# EAGLE design polarshield3.0b (EAGLE 7.2.0)
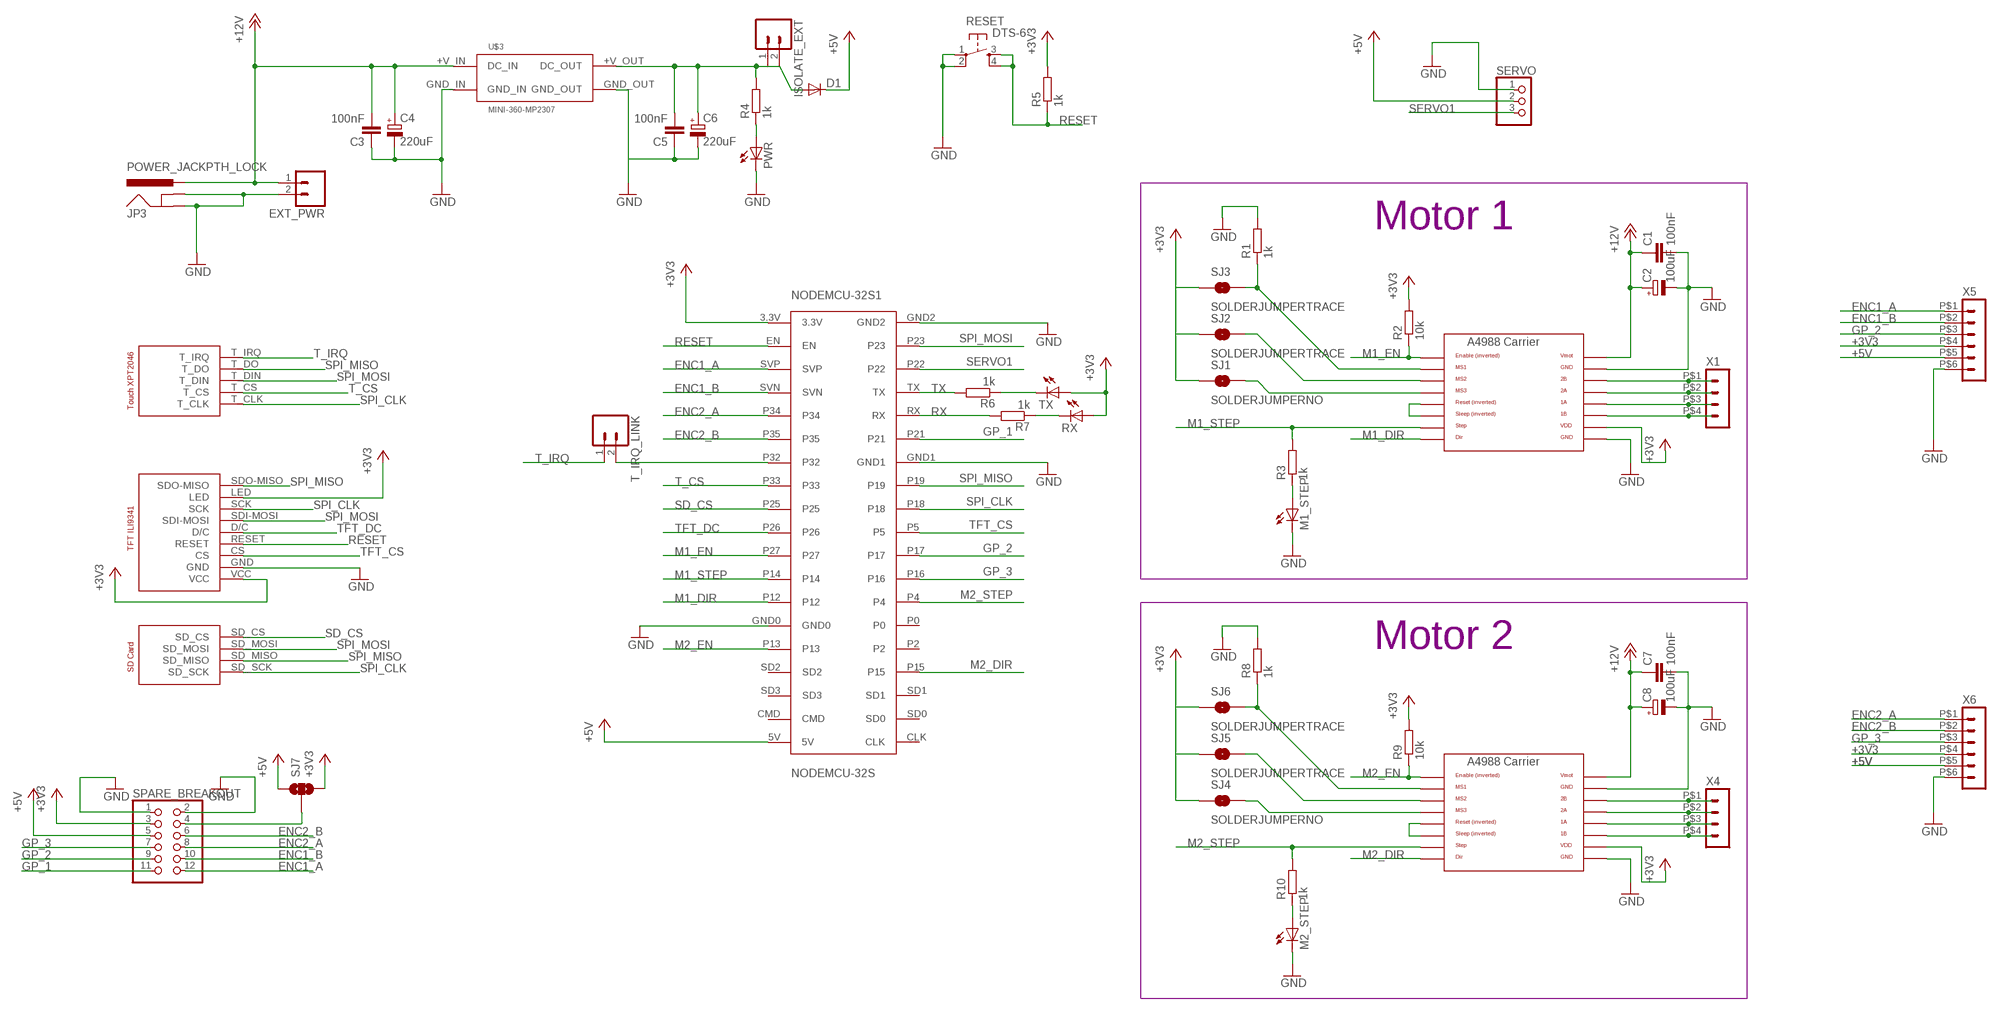
[diagram p0: schematic, sheet 1]

## Parts
C1  100nF  C-EUC0805  [C0805]
C2  100uF  CPOL-EU153CLV-0605  [153CLV-0605]
C3  100nF  C-EUC0805  [C0805]
C4  220uF  CPOL-EU153CLV-0605  [153CLV-0605]
C5  100nF  C-EUC0805  [C0805]
C6  220uF  CPOL-EU153CLV-0605  [153CLV-0605]
C7  100nF  C-EUC0805  [C0805]
C8  100uF  CPOL-EU153CLV-0605  [153CLV-0605]
D1  DIODE-DO214BA  [DO214BA]
EXT_PWR  M02PTH  [1X02]
ISOLATE_EXT  M02PTH  [1X02]
JP3  POWER_JACKPTH_LOCK  [POWER_JACK_PTH_LOCK]
M1_STEP  LEDCHIPLED_0805  [CHIPLED_0805]
M2_STEP  LEDCHIPLED_0805  [CHIPLED_0805]
MOTOR_1  A4988BREAKOUT  [A4988BREAKOUT]
MOTOR_2  A4988BREAKOUT  [A4988BREAKOUT]
NODEMCU-32S1  NODEMCU-32S  [NODEMCU-32S]
PWR  LEDCHIPLED_0805  [CHIPLED_0805]
R1  1k  R-EU_M0805  [M0805]
R2  10k  R-EU_M0805  [M0805]
R3  1k  R-EU_M0805  [M0805]
R4  1k  R-EU_M0805  [M0805]
R5  1k  R-EU_M0805  [M0805]
R6  1k  R-EU_M0805  [M0805]
R7  1k  R-EU_M0805  [M0805]
R8  1k  R-EU_M0805  [M0805]
R9  10k  R-EU_M0805  [M0805]
R10  1k  R-EU_M0805  [M0805]
RESET  DTS-6  [DTS-6]
RX  LEDCHIPLED_0805  [CHIPLED_0805]
SERVO  PINHD-1X3/90  [1X03/90]
SJ1  SOLDERJUMPERNO  [SJ_2S-NO]
SJ2  SOLDERJUMPERTRACE  [SJ_2S-TRACE]
SJ3  SOLDERJUMPERTRACE  [SJ_2S-TRACE]
SJ4  SOLDERJUMPERNO  [SJ_2S-NO]
SJ5  SOLDERJUMPERTRACE  [SJ_2S-TRACE]
SJ6  SOLDERJUMPERTRACE  [SJ_2S-TRACE]
SJ7  SOLDERJUMPER_2WAYPASTE1&2  [SJ_3_PASTE1&2]
SPARE_BREAKOUT  PINHD-2X6  [2X06]
T_IRQ_LINK  M02PTH  [1X02]
TX  LEDCHIPLED_0805  [CHIPLED_0805]
U$2  2.4_TFT_SPI_TOUCH_SD  [2.4_TFT_SPI_TOUCH_SD]
U$3  MINI-360-MP2307  [MINI-360-MP2307]
X1  HEADER_POS4_43045-0401  [43045-0400]
X4  HEADER_POS4_43045-0401  [43045-0400]
X5  HEADER_POS6_43045-0600  [43045-0600]
X6  HEADER_POS6_43045-0600  [43045-0600]

## Nets
+3V3 [VCC]: MOTOR_1.VDD MOTOR_2.VDD NODEMCU-32S1.3.3V R2.2 R5.2 R9.2 RX.A SJ1.1 SJ2.1 SJ3.1 SJ4.1 SJ5.1 SJ6.1 SJ7.3 SPARE_BREAKOUT.3 TX.A U$2.LED U$2.VCC X5.P$4 X6.P$4
+5V [VCC]: D1.C NODEMCU-32S1.5V SERVO.2 SJ7.1 SPARE_BREAKOUT.5 X5.P$5 X6.P$5
+12V [VMOT]: C1.1 C2.+ C3.2 C4.+ C7.1 C8.+ EXT_PWR.1 JP3.PWR MOTOR_1.VMOT MOTOR_2.VMOT U$3.+V_IN(DC_IN)
ENC1_A: NODEMCU-32S1.SVP SPARE_BREAKOUT.12 X5.P$1
ENC1_B: NODEMCU-32S1.SVN SPARE_BREAKOUT.10 X5.P$2
ENC2_A: NODEMCU-32S1.P34 SPARE_BREAKOUT.8 X6.P$1
ENC2_B: NODEMCU-32S1.P35 SPARE_BREAKOUT.6 X6.P$2
GND [GND]: C1.2 C2.- C3.1 C4.- C5.1 C6.- C7.2 C8.- EXT_PWR.2 JP3.GND JP3.GNDBREAK M1_STEP.C M2_STEP.C MOTOR_1.GND MOTOR_1.GND@0(GND) MOTOR_2.GND MOTOR_2.GND@0(GND) NODEMCU-32S1.GND0 NODEMCU-32S1.GND1 NODEMCU-32S1.GND2 PWR.C R1.2 R8.2 RESET.1 RESET.2 SERVO.1 SPARE_BREAKOUT.1 SPARE_BREAKOUT.2 U$2.GND U$3.GND_IN U$3.GND_OUT X5.P$6 X6.P$6
GP_1: NODEMCU-32S1.P21 SPARE_BREAKOUT.11
GP_2: NODEMCU-32S1.P17 SPARE_BREAKOUT.9 X5.P$3
GP_3: NODEMCU-32S1.P16 SPARE_BREAKOUT.7 X6.P$3
M1_DIR: MOTOR_1.DIR NODEMCU-32S1.P12
M1_EN: MOTOR_1.EN NODEMCU-32S1.P27 R2.1
M1_STEP: MOTOR_1.STEP NODEMCU-32S1.P14 R3.2
M2_DIR: MOTOR_2.DIR NODEMCU-32S1.P15
M2_EN: MOTOR_2.EN NODEMCU-32S1.P13 R9.1
M2_STEP: MOTOR_2.STEP NODEMCU-32S1.P4 R10.2
N$1: NODEMCU-32S1.P32 T_IRQ_LINK.2
N$2: MOTOR_1.RST MOTOR_1.SLP(SLEEP)
N$3: MOTOR_1.MS3 SJ1.2
N$4: MOTOR_1.MS2 SJ2.2
N$5: MOTOR_1.MS1 R1.1 SJ3.2
N$6: M1_STEP.A R3.1
N$7 [VCC]: C5.2 C6.+ D1.A ISOLATE_EXT.1 ISOLATE_EXT.2 R4.2 U$3.+V_OUT(DC_OUT)
N$8: PWR.A R4.1
N$9: MOTOR_2.MS3 SJ4.2
N$10 [VMOT]: MOTOR_1.2B X1.P$1
N$11 [VMOT]: MOTOR_1.2A X1.P$2
N$12 [VMOT]: MOTOR_1.1A X1.P$3
N$13 [VMOT]: MOTOR_1.1B X1.P$4
N$14: R6.1 TX.C
N$15: R7.1 RX.C
N$16: MOTOR_2.MS2 SJ5.2
N$17: MOTOR_2.MS1 R8.1 SJ6.2
N$18: MOTOR_2.RST MOTOR_2.SLP(SLEEP)
N$19: M2_STEP.A R10.1
N$24 [VMOT]: MOTOR_2.1B X4.P$4
N$25 [VMOT]: MOTOR_2.2B X4.P$1
N$26 [VMOT]: MOTOR_2.2A X4.P$2
N$27 [VMOT]: MOTOR_2.1A X4.P$3
N$28: SJ7.2 SPARE_BREAKOUT.4
RESET: NODEMCU-32S1.EN R5.1 RESET.3 RESET.4 U$2.RESET
RX: NODEMCU-32S1.RX R7.2
SD_CS: NODEMCU-32S1.P25 U$2.SD_CS
SERVO1: NODEMCU-32S1.P22 SERVO.3
SPI_CLK: NODEMCU-32S1.P18 U$2.SCK U$2.SD_SCK U$2.T_CLK
SPI_MISO: NODEMCU-32S1.P19 U$2.SD_MISO U$2.SDO-MISO U$2.T_DO
SPI_MOSI: NODEMCU-32S1.P23 U$2.SD_MOSI U$2.SDI-MOSI U$2.T_DIN
T_CS: NODEMCU-32S1.P33 U$2.T_CS
T_IRQ: T_IRQ_LINK.1 U$2.T_IRQ
TFT_CS: NODEMCU-32S1.P5 U$2.CS
TFT_DC: NODEMCU-32S1.P26 U$2.D/C
TX: NODEMCU-32S1.TX R6.2
Unconnected: NODEMCU-32S1.CLK NODEMCU-32S1.CMD NODEMCU-32S1.P0 NODEMCU-32S1.P2 NODEMCU-32S1.SD0 NODEMCU-32S1.SD1 NODEMCU-32S1.SD2 NODEMCU-32S1.SD3

## Notes on the sheet
- Motor 1
- Motor 2

## Library data of the parts
C1 C3 C5 C7 = resistor:C-EU: CAPACITOR, European symbol
C2 C4 C6 C8 = resistor:CPOL-EU: POLARIZED CAPACITOR, European symbol
D1 = diode:DIODE-: DIODE
EXT_PWR ISOLATE_EXT T_IRQ_LINK = SparkFun-Connectors:M02: Standard 2-pin 0.1" header. Use with - straight break away headers ( PRT-00116) - right angle break away headers (PRT-00553) - swiss pins (PRT-00743) - machine pins (PRT-00117) - female headers (PRT-00115) Molex polarized connector foot print use with: PRT-08233 with associated crimp pins and housings. 2.54_SCREWTERM for use with PRT-10571. 3.5mm Screw Terminal footprints for PRT-08084 5mm Screw Terminal footprints for use with PRT-08432
JP3 = SparkFun-Connectors:POWER_JACK: Power Jack This is the standard 5.5mm barrel jack for power. The PTH is the most common, proven, reliable, footprint. The Slot footprint only works if the mill layer is transmitted to the PCB fab house so be warned. Mating wall wart : TOL-00298 (and others); PROD_ID: CONN-08197; SF_ID: PRT-00119
M1_STEP M2_STEP PWR RX TX = polargraph3:LED: LED OSRAM: - CHIPLED LG R971, LG N971, LY N971, LG Q971, LY Q971, LO R971, LY R971 LH N974, LH R974 LS Q976, LO Q976, LY Q976 LO Q996 - Hyper CHIPLED LW Q18S LB Q993, LB Q99A, LB R99A - SideLED LS A670, LO A670, LY A670, LG A670, LP A670 LB A673, LV A673, LT A673, LW A673 LH A674 LY A675 LS A676, LA A676, LO A676, LY A676, LW A676 LS A679, LY A679, LG A679 - Hyper Micro SIDELED® LS Y876, LA Y876, LO Y876, LY Y876 LT Y87S - SmartLED LW L88C, LW L88S LB L89C, LB L89S, LG L890 LS L89K, LO L89K, LY L89K LS L896, LA L896, LO L896, LY L896 - TOPLED LS T670, LO T670, LY T670, LG T670, LP T670 LSG T670, LSP T670, LSY T670, LOP T670, LYG T670 LG T671, LOG T671, LSG T671 LB T673, LV T673, LT T673, LW T673 LH T674 LS T676, LA T676, LO T676, LY T676, LB T676, LH T676, LSB T676, LW T676 LB T67C, LV T67C, LT T67C, LS T67K, LO T67K, LY T67K, LW E67C LS E67B, LA E67B, LO E67B, LY E67B, LB E67C, LV E67C, LT E67C LW T67C LS T679, LY T679, LG T679 LS T770, LO T770, LY T770, LG T770, LP T770 LB T773, LV T773, LT T773, LW T773 LH T774 LS E675, LA E675, LY E675, LS T675 LS T776, LA T776, LO T776, LY T776, LB T776 LHGB T686 LT T68C, LB T68C - Hyper Mini TOPLED® LB M676 - Mini TOPLED Santana® LG M470 LS M47K, LO M47K, LY M47K Source: http://www.osram.convergy.de LUXEON: - LUMILED® LXK2-PW12-R00, LXK2-PW12-S00, LXK2-PW14-U00, LXK2-PW14-V00 LXK2-PM12-R00, LXK2-PM12-S00, LXK2-PM14-U00 LXK2-PE12-Q00, LXK2-PE12-R00, LXK2-PE12-S00, LXK2-PE14-T00, LXK2-PE14-U00 LXK2-PB12-K00, LXK2-PB12-L00, LXK2-PB12-M00, LXK2-PB14-N00, LXK2-PB14-P00, LXK2-PB14-Q00 LXK2-PR12-L00, LXK2-PR12-M00, LXK2-PR14-Q00, LXK2-PR14-R00 LXK2-PD12-Q00, LXK2-PD12-R00, LXK2-PD12-S00 LXK2-PH12-R00, LXK2-PH12-S00 LXK2-PL12-P00, LXK2-PL12-Q00, LXK2-PL12-R00 Source: www.luxeon.com KINGBRIGHT: KA-3528ASYC Source: www.kingbright.com
MOTOR_1 MOTOR_2 = sandy:A4988BREAKOUT
NODEMCU-32S1 = sandy:NODEMCU-32S
R1-R10 = resistor:R-EU_: RESISTOR, European symbol
RESET = switch-tact:DTS-6
SERVO = pinhead:PINHD-1X3: PIN HEADER
SJ1-SJ6 = polargraph3:SOLDERJUMPER: Solder Jumper Standard SMD solder jumper. Used to automate production. Two varients : Normally Open and Normally Closed are the same, but have different paste layers. NC will have a large amount of paste and should jumper during reflow.
SJ7 = SparkFun-Retired:SOLDERJUMPER_2WAY: Solder Jumper 2 way solder jumper
SPARE_BREAKOUT = pinhead:PINHD-2X6: PIN HEADER
U$2 = polargraph3:2.4_TFT_SPI_TOUCH_SD
U$3 = polargraph3:MINI-360-MP2307
X1 X4 = con-molex-micro-fit-3_0:HEADER_POS4_?: Molex - Micro-Fit 3.0 Series connector, 3.00mm (0.118") pitch header, 4 positions.
X5 X6 = con-molex-micro-fit-3_0:HEADER_POS6_?: Molex - Micro-Fit 3.0 Series connector, 3.00mm (0.118") pitch header, 6 positions.

## Net classes
0 signal: width 0.254 mm, drill 0.152 mm, clearance 0.203 mm
1 VMOT: width 1.118 mm, drill 0.152 mm, clearance 0.305 mm
2 VCC: width 0.61 mm, drill 0.152 mm, clearance 0.203 mm
3 GND: width 0.305 mm, drill 0.152 mm, clearance 0.203 mm

## Board
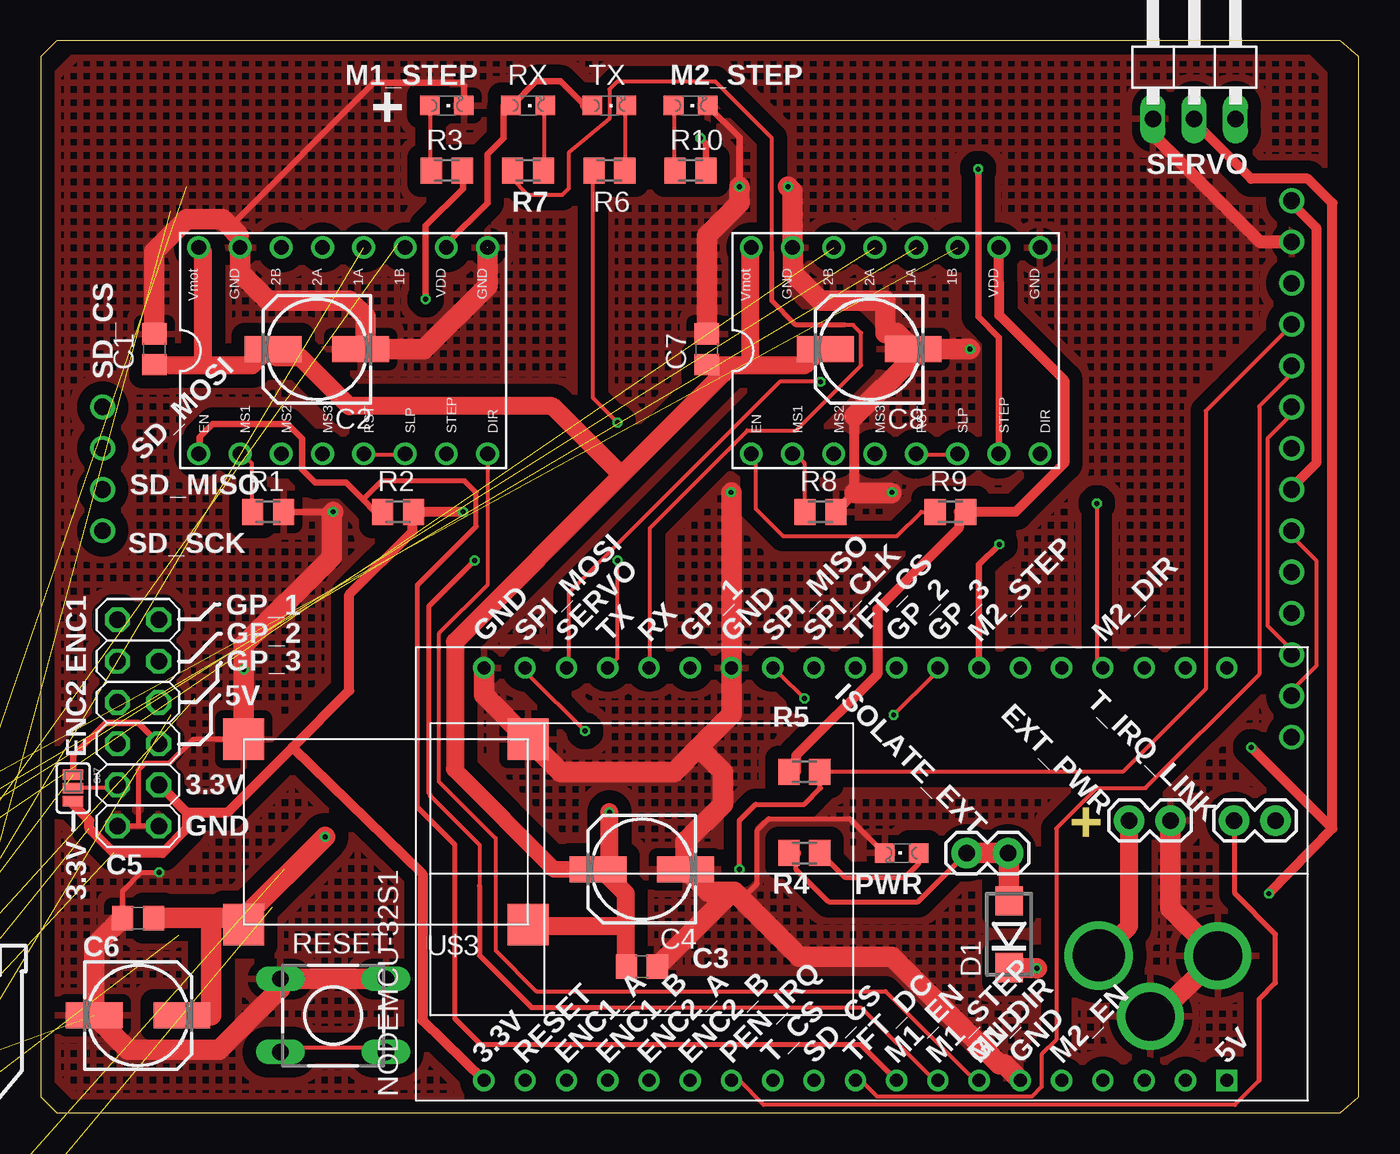
[diagram p1: board, top side]
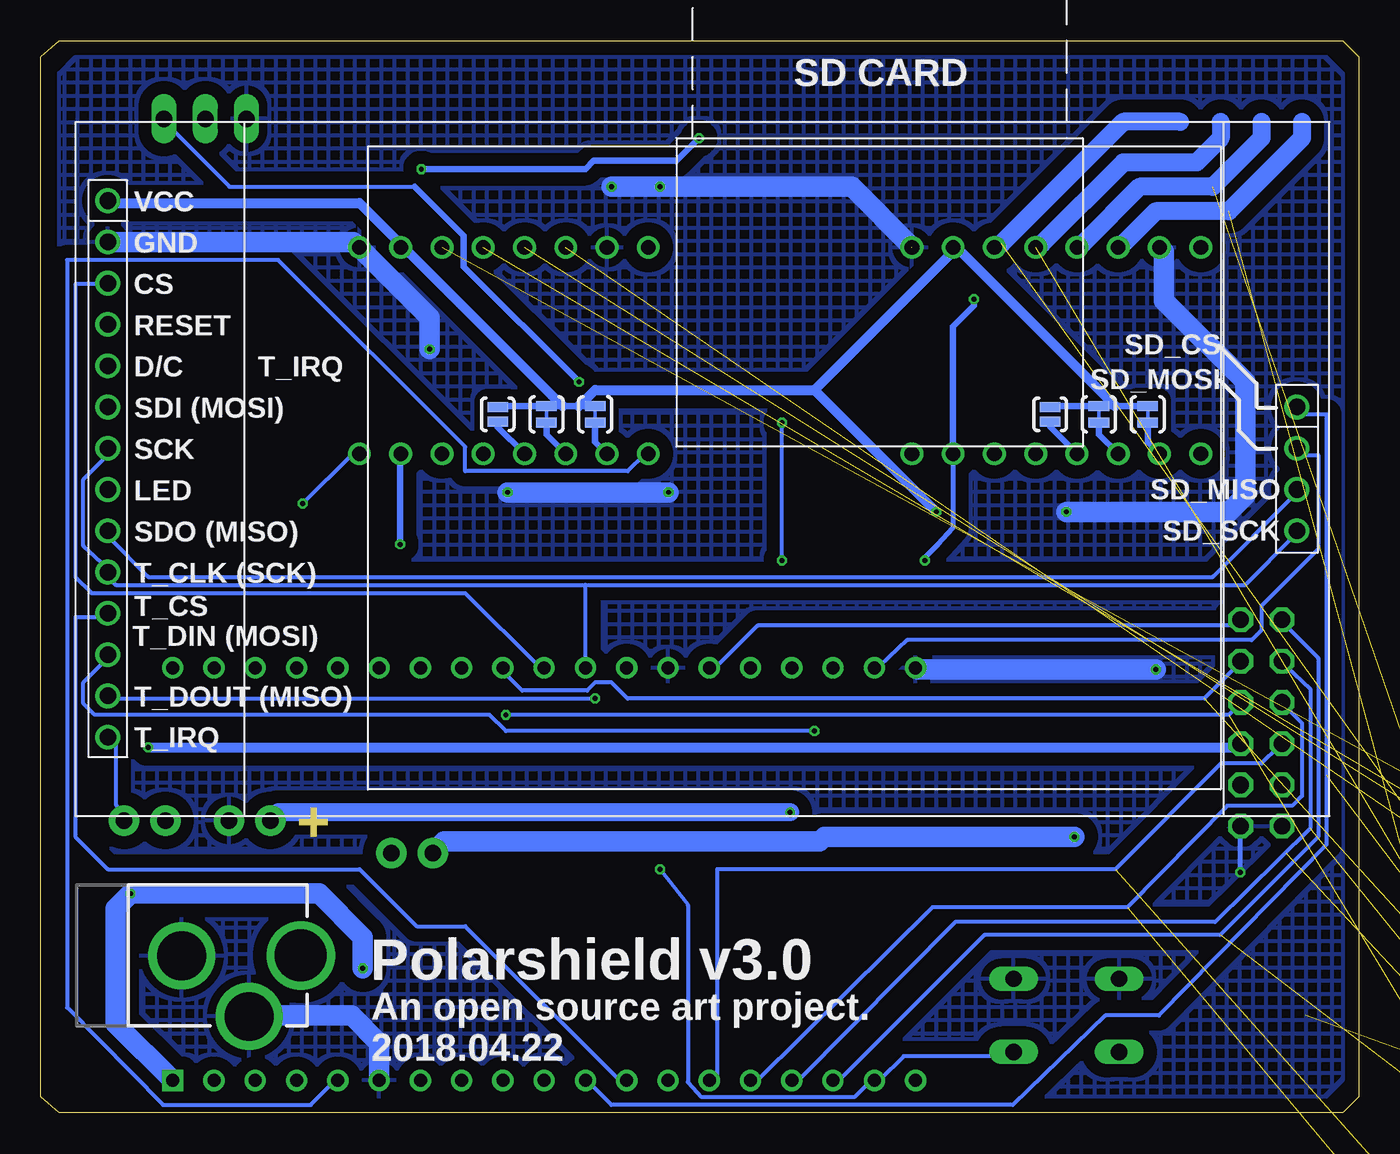
[diagram p2: board, bottom side, seen from below]

Size 81.13 x 66 mm. Coordinates in mm from the lower left corner, seen from the top.
Outline: 0,1 1,0 80,0 81.13,1 81.13,65 80,66 1,66 0,65 0,1
Copper layers (1*16): Top 0.035mm / dielectric 1.5mm / Bottom 0.035mm
Design rules "SeeedStudio_2layer_DRU_no_angle_20140221 *": minimum track width 6mil, minimum drill 12mil, track to track 6mil, track to pad 6mil, pad to pad 6mil, via to via 6mil, smd to smd 0mil, copper to edge 10mil, drill to drill 10mil, minimum pad ring 10mil, minimum via ring 6mil, stop-mask expansion 2mil, vias tented up to drill 100mil, thermal gap 20mil

### Footprints (pad centres in the part's own frame; a part is rotated, then mirrored left to right if it is on the bottom)
C0805 = smd 1.3 x 1.5: 1 -0.95,0; 2 0.95,0
153CLV-0605 = smd 3.5 x 1.6: + 2.7,0; - -2.7,0
DO214BA = smd 1.8 x 1.7: A 2.05,0; C -2.05,0
1X02 = drill 1.016 pad 1.88: 1 0,0; 2 2.54,0
POWER_JACK_PTH_LOCK = drill 2.997 pad 4.115: GND 0.025,6.557; GNDBREAK 3.762,10.7 | drill 3.2 pad 4.115: PWR 0,13.878
CHIPLED_0805 = smd 1.2 x 1.2: A 0,-1.05; C 0,1.05
A4988BREAKOUT = drill 0.9: 1A 8.89,1.27; 1B 11.43,1.27; 2A 6.35,1.27; 2B 3.81,1.27; DIR 16.51,-11.43; EN -1.27,-11.43; GND 16.51,1.27; GND@0 1.27,1.27; MS1 1.27,-11.43; MS2 3.81,-11.43; MS3 6.35,-11.43; RST 8.89,-11.43; SLP 11.43,-11.43; STEP 13.97,-11.43; VDD 13.97,1.27; VMOT -1.27,1.27
NODEMCU-32S = drill 0.8: 3.3V 0,45.72; CLK 25.4,0; CMD 0,2.54; EN 0,43.18; GND0 0,12.7; GND1 25.4,30.48; GND2 25.4,45.72; P0 25.4,12.7; P2 25.4,10.16; P4 25.4,15.24; P5 25.4,22.86; P12 0,15.24; P13 0,10.16; P14 0,17.78; P15 25.4,7.62; P16 25.4,17.78; P17 25.4,20.32; P18 25.4,25.4; P19 25.4,27.94; P21 25.4,33.02; P22 25.4,40.64; P23 25.4,43.18; P25 0,25.4; P26 0,22.86; P27 0,20.32; P32 0,30.48; P33 0,27.94; P34 0,35.56; P35 0,33.02; RX 25.4,35.56; SD0 25.4,2.54; SD1 25.4,5.08; SD2 0,7.62; SD3 0,5.08; SVN 0,38.1; SVP 0,40.64; TX 25.4,38.1 | drill 0.8 square: 5V 0,0
M0805 = smd 1.3 x 1.6: 1 -0.95,0; 2 0.95,0
DTS-6 = drill 1 long: 1 -3.25,2.25; 2 3.25,2.25; 3 -3.25,-2.25; 4 3.25,-2.25
1X03/90 = drill 1.016 long: 1 -2.54,-3.81; 2 0,-3.81; 3 2.54,-3.81
SJ_2S-NO = smd 0.635 x 1.27: 1 -0.45,0; 2 0.45,0
SJ_2S-TRACE = smd 0.635 x 1.27: 1 -0.508,0; 2 0.508,0
SJ_3_PASTE1&2 = smd 0.635 x 1.27: 1 -0.813,0; 2 0,0; 3 0.813,0
2X06 = drill 1.016 octagon: 1 -6.35,-1.27; 2 -6.35,1.27; 3 -3.81,-1.27; 4 -3.81,1.27; 5 -1.27,-1.27; 6 -1.27,1.27; 7 1.27,-1.27; 8 1.27,1.27; 9 3.81,-1.27; 10 3.81,1.27; 11 6.35,-1.27; 12 6.35,1.27
2.4_TFT_SPI_TOUCH_SD = drill 1.016: CS 9.93,2; D/C 15.01,2; GND 7.39,2; LED 22.63,2; RESET 12.47,2; SCK 20.09,2; SD_CS 17.55,75.18; SD_MISO 22.63,75.18; SD_MOSI 20.09,75.18; SD_SCK 25.17,75.18; SDI-MOSI 17.55,2; SDO-MISO 25.17,2; T_CLK 27.71,2; T_CS 30.25,2; T_DIN 32.79,2; T_DO 35.33,2; T_IRQ 37.87,2; VCC 4.85,2
MINI-360-MP2307 = smd 2.54 x 2.54: +V_IN -1,10.4; +V_OUT 16.5,10.4; GND_IN -1,-1; GND_OUT 16.5,-1
43045-0400 = drill 1.02 square: P$1 1.5,4.32 | drill 1.02: P$2 -1.5,4.32; P$3 1.5,7.32; P$4 -1.5,7.32 | hole 3: 0,0
43045-0600 = drill 1.02 square: P$1 3,4.32 | drill 1.02: P$2 0,4.32; P$3 -3,4.32; P$4 3,7.32; P$5 0,7.32; P$6 -3,7.32 | hole 3: 0,0

### Placement (x,y rotation side)
C1  7,47 90 top
C2  17,47 180 top
C3  37,9 180 top
C4  37,15 180 top
C5  6,12 0 top
C6  6,6 0 top
C7  41,47 90 top
C8  51,47 180 top
D1  59.6,11 90 top
EXT_PWR  67,18 0 top
ISOLATE_EXT  57,16 0 top
JP3  79,9.7 270 bottom
M1_STEP  25,62 270 top
M2_STEP  40,62 270 top
MOTOR_1  11,52 0 top
MOTOR_2  45,52 0 top
NODEMCU-32S1  73,2 90 top
PWR  53,16 90 top
R1  14,37 0 top
R2  22,37 0 top
R3  25,58 0 top
R4  47,16 180 top
R5  47,21 180 top
R6  35,58 180 top
R7  30,58 180 top
R8  48,37 0 top
R9  56,37 0 top
R10  40,58 0 top
RESET  18,6 0 top
RX  30,62 270 top
SERVO  71,65 0 top
SJ1  19,43 270 bottom
SJ2  16,43 270 bottom
SJ3  13,43 270 bottom
SJ4  53,43 270 bottom
SJ5  50,43 270 bottom
SJ6  47,43 270 bottom
SJ7  2,20 270 top
SPARE_BREAKOUT  6,24 90 top
T_IRQ_LINK  76,18 180 top
TX  35,62 270 top
U$2  79,61 270 bottom
U$3  29,22 180 top
X1  -6,5 0 top  (outside the outline)
X4  -17,5 0 top  (outside the outline)
X5  -15,-9 0 top  (outside the outline)
X6  -15,-23 0 top  (outside the outline)

### Tracks (layer width: path | path; a pad name or v marks a point on that pad's centre or on a via)
+3V3  (via drill 0.3)  (2 unrouted)
  Top 0.406: 29,62 30.5,63.5 32,63.5 33.5,62 | 25,53.5 27.5,56 27.5,59 28.5,60 28.5,62 RX.A
  Top 0.61: 9,18.5 9,17.5 7.5,16 4.5,16 3,17.5 3,18 2,19 SJ7.3 | 9,18.5 7.5,20 SPARE_BREAKOUT.3 | 15.5,22.5 11.5,18.5 9,18.5 | 15.5,22.5 19,26 19,31.9 22.9,35.8 22.9,36.95 R2.2 v26,37 | 15.5,22.5 23.5,14.7 23.5,5.7 NODEMCU-32S1.3.3V | 29,62 RX.A | 33.5,62 TX.A | 25,53.5 MOTOR_1.VDD | R5.2 46.5,21 46.5,22 51.5,27 51.5,31 56.5,36 56.5,37 R9.2 60,37 63,40 63,45.1 59,49.1 MOTOR_2.VDD | U$2.LED 77,38.5 78.5,40 78.5,54.5 77,56 U$2.VCC
  Bottom 0.406: SJ3.1 15,43.51 SJ2.1 19,43.51 SJ1.1 | SJ6.1 48,43.51 49,43.51 SJ5.1 52.94,43.51 SJ4.1
  Bottom 0.61: 15,43.51 15,43.5 24.5,53 MOTOR_1.VDD 25,53 33.5,44.5 | 49,43.51 49,43.5 58.5,53 MOTOR_2.VDD 59,53.5 61.5,56 77,56 U$2.VCC | 33.5,44.5 47,44.5 48,43.5 48,43.51 | 33.5,44.5 v26,37
+5V  (via drill 0.3)  (2 unrouted)
  Top 0.406: SJ7.1 2,22 4,24 6,24 SPARE_BREAKOUT.5
  Top 0.61: 79.5,17.5 79.5,56 78,57.5 74.5,57.5 71,61 SERVO.2 | v75.6,13.5 79.5,17.5 | 79.5,17.5 v74.5,22.5
  Top 1.27: v61.3,8.9 D1.C
  Bottom 0.61: v74.5,22.5 7.5,22.5 SPARE_BREAKOUT.5
  Bottom 1.27: v61.3,8.9 61.3,10.8 64,13.5 v75.6,13.5 76.5,12.6 76.5,5.5 NODEMCU-32S1.5V
+12V  (via drill 0.3)
  Top 1.016: 25.5,21.2 25.5,21.1 31.6,15 C4.+
  Top 1.118: EXT_PWR.1 67,11.5 65.5,10 JP3.PWR | 10,46 13,46 14,47 C2.+ 14.5,46.5 16,46.5 19,43.5 31.5,43.5 35.75,39.25 | 10,46 8,46 C1.1 | 10,46 10,53 MOTOR_1.VMOT | 36,11.5 36,13.5 35,14.5 | 36,11.5 36,9 C3.2 | 35,14.5 34.5,15 C4.+ | 36,11.5 30,11.5 U$3.+V_IN | 43.7,46 47,46 48,47 C8.+ | 43.7,46 42,46 C7.1 42,45.5 35.75,39.25 | 43.7,46 43.7,53 MOTOR_2.VMOT | 25.5,21.2 25.5,29 35.75,39.25 | 34,15 C4.+ | 35,14.5 v35,18.5 | 35,14.5 C4.+
  Bottom 1.118: EXT_PWR.1 66.5,18.5 v35,18.5
ENC1_A  (1 unrouted)
  Bottom 0.254: NODEMCU-32S1.SVP 32,2 23.04,10.96 8.54,10.96 2.5,17 2.5,28 4.5,30 SPARE_BREAKOUT.12
ENC1_B  (1 unrouted)
  Bottom 0.254: NODEMCU-32S1.SVN 34.5,2 24.84,11.76 8.84,11.76 3,17.5 3,26.1 4.5,27.5 SPARE_BREAKOUT.10
ENC2_A  (1 unrouted)
  Bottom 0.254: NODEMCU-32S1.P34 37,2 26.24,12.66 14.24,12.66 8.1,18.9 4.1,18.9 3.5,19.5 3.5,24 4.5,25 SPARE_BREAKOUT.8
ENC2_B  (1 unrouted)
  Bottom 0.254: NODEMCU-32S1.P35 39.5,2 39.5,15 15,15 8.5,21.5 6,21.5 5,22.5 SPARE_BREAKOUT.6
GND  (via drill 0.3)  (3 unrouted)
  Top 0.305: MOTOR_2.GND@0 46.73,53.27 | U$3.GND_OUT 9.4,23 7.9,21.5 6.4,21.5 6,21.1 6,17.7 | 6,17.7 7.22,17.7 SPARE_BREAKOUT.1 | v52.4,38.2 52.35,38.15 | PWR.C 51.9,16 49.8,18.1 44.8,18.1 44.1,17.4 44.1,14.1 43.6,13.6 42.7,13.6 42.5,13.6 42.5,13.55 | 14.75,7.65 RESET.1 | 6,17.7 5.95,17.65 SPARE_BREAKOUT.2 | C5.1 5.05,13.65 6.2,14.8 v7.3,14.8
  Top 0.406: R1.2 v18,37 | 11.65,54.55 20.5,63.4 25.9,63.4 26.05,63.25 M1_STEP.C | v43,57 43,60.05 M2_STEP.C
  Top 0.61: R8.2 50.1,38.15 50.1,42.9 | 53.7,46.5 C8.-
  Top 0.813: 12.2,54 12.2,53.34 MOTOR_1.GND@0 | 20,47.3 C2.- | MOTOR_1.GND | M1_STEP.C 26.2,62 | SERVO.1 68.46,60.22 75.07,53.61 U$2.GND
  Top 1.27: v46,57 46.27,56.73 MOTOR_2.GND@0 46.3,53.24 46.3,51.7 48,50 52,50 52,48 52.7,48 C8.- v57.2,47 | v43,57 43,56 41,54 C7.2 | C1.2 7,53 9,55 11.2,55 11.65,54.55 12.2,54 | MOTOR_1.GND@0 12.27,51.73 14,50 19,50 20,49 20,47.3 | C2.- 23.6,47 27.5,50.9 MOTOR_1.GND | 50.1,42.9 53.7,46.5 | 42.52,38.18 NODEMCU-32S1.GND1 42.52,24.52 40.5,22.5 | 52.35,38.15 50.1,38.15 | 42.5,13.6 41.1,13.6 C4.- 39.7,16.7 42,19 42,21 40.5,22.5 | NODEMCU-32S1.GND0 59.3,3 59,3 52.4,9.6 46.7,9.6 42.7,13.6 | C3.1 42.5,13.55 | RESET.2 RESET.1 | 14.75,7.65 11,3.9 5.4,3.9 C6.- 3.3,10.25 C5.1 | EXT_PWR.2 69.54,12.58 JP3.GND 68.71,5.94 JP3.GNDBREAK | NODEMCU-32S1.GND2 27.28,25.72 U$3.GND_IN 32,21 39,21 40.5,22.5 | U$3.GND_OUT v12.5,27.3 12.5,28.8 17.9,34.2 17.9,36.9 v18,37
  Bottom 0.305: v7.3,14.8 7.3,17.62 SPARE_BREAKOUT.1
  Bottom 1.27: v46,57 v43,57 31.2,57 27.5,53.3 | v57.2,47 57.2,48.96 MOTOR_2.GND 61.47,53.27 61.9,53.6 76.91,53.6 U$2.GND | v42.5,38.2 v52.4,38.2 | v18,37 8,37 7,38 7,45 12,50 12,53 MOTOR_1.GND@0 | NODEMCU-32S1.GND0 60.3,4.3 62,6 68.24,6 JP3.GNDBREAK | v12.5,27.3 27.18,27.3 NODEMCU-32S1.GND2
  pour Top (isolate 0.813, hatched): 1,64 2,65 78,65 79,64 79,2 78,1 2,1 1,2
  pour Bottom (isolate 0.813, hatched): 2,65 1,64 1,2 2,1 79,1 80,2 80,64 79,65
GP_1
  Bottom 0.254: NODEMCU-32S1.P21 39.5,27.5 37,30 7.5,30 SPARE_BREAKOUT.11
GP_2  (1 unrouted)
  Bottom 0.254: NODEMCU-32S1.P17 52.5,27 51.5,26 47.5,26 47,26.5 46,26.5 45,25.5 9.5,25.5 7.5,27.5 SPARE_BREAKOUT.9
GP_3  (via drill 0.3)  (1 unrouted)
  Top 0.254: v52.5,24.5 55,27 NODEMCU-32S1.P16
  Bottom 0.254: v52.5,24.5 8,24.5 7.5,25 SPARE_BREAKOUT.7
M1_DIR
  Top 0.254: 27.5,40.5 27.5,32.5 24.5,29.5 24.5,20.4 28,16.9 28,10 30.5,7.5 52,7.5 57.5,2 NODEMCU-32S1.P12
  Top 0.305: MOTOR_1.DIR 27.51,40.51 27.5,40.5
M1_EN
  Top 0.254: 21,37 R2.1
  Top 0.305: NODEMCU-32S1.P27 50.48,4.2 27.1,4.2 25.5,5.8 25.5,16.5 23.2,18.8 23.2,32.5 26.8,36.1 26.8,38.2 26.1,38.9 21,38.9 19.85,37.75
  Top 0.406: 21,37 20.6,37 19.85,37.75 18.8,38.8 16.9,38.8 16.1,39.6 16.1,41.5 15.2,42.4 10.6,42.4 9.8,41.6 9.8,40.64 MOTOR_1.EN
M1_STEP  (via drill 0.3)
  Top 0.254: 25.5,58 R3.2 | 34.5,6.5 50.5,6.5 55,2 NODEMCU-32S1.P14 | 27,14 27,16.5 24,19.5
  Top 0.305: 27,14 27,9.7 30.2,6.5 34.5,6.5 | 24,19.5 23.9,19.7 23.9,31.2 v26.7,34
  Top 0.406: R3.2 26,57.95 26,56.9 23.7,54.6 v23.7,50.1
  Bottom 0.305: MOTOR_1.STEP 24.97,36.53 25,36 25.9,35 26.7,34.2 v26.7,34
  Bottom 0.406: v23.7,50.1 23.7,49.7 25,48.4 25,40.6 MOTOR_1.STEP
M2_DIR  (via drill 0.3)
  Top 0.254: v65,37.5 65,27.5 NODEMCU-32S1.P15
  Bottom 0.254: v65,37.5 62,40.5 MOTOR_2.DIR
M2_EN
  Top 0.254: R9.1 54.2,37 52.7,35.5 45.7,35.5 44,37.2 44,40.5 MOTOR_2.EN
  Bottom 0.254: NODEMCU-32S1.P13 63,2 64.5,0.5 73.6,0.5 79.5,6.5 79.5,52.5 66.5,52.5 55,41 55,39.5 45,39.5 44,40.5 MOTOR_2.EN
M2_STEP  (via drill 0.3)
  Top 0.406: R10.2 40.95,59.65 v40.6,60 | NODEMCU-32S1.P4 57.76,33.76 v59,35 | MOTOR_2.STEP 58.97,47.73 57.7,49 v57.7,58.1
  Bottom 0.406: v59,35 59,40.54 MOTOR_2.STEP | v57.7,58.1 47.6,58.1 47.1,58.6 42,58.6 v40.6,60
N$1
  Top 0.254: 75,2 73.5,0.5 44.5,0.5 43,2 NODEMCU-32S1.P32
  Top 0.305: 75,2 75,7 76,8 76,11 73.5,13.5 73.5,17.96 T_IRQ_LINK.2
N$2
  Top 0.254: MOTOR_1.RST 20,40.5 22,40.5 MOTOR_1.SLP
N$3
  Bottom 0.406: SJ1.2 19,42.22 MOTOR_1.MS3
N$4
  Bottom 0.406: SJ2.2 16,41.76 MOTOR_1.MS2
N$5
  Top 0.254: R1.1 13,37 13,40 12.5,40.5 MOTOR_1.MS1
  Bottom 0.406: SJ3.2 13,41.3 MOTOR_1.MS1
N$6
  Top 0.254: M1_STEP.A 24,62 24,58 R3.1
N$7  (via drill 0.3)
  Top 0.305: 46.5,16 46.5,15 48.5,13 54,13 ISOLATE_EXT.1
  Top 0.61: 10.5,6 C6.+ | 46.5,16 R4.2 | 12.5,12 U$3.+V_OUT
  Top 1.27: 10.5,12 12.5,12 v17.5,17 | 10.5,12 C5.2 | 10.5,12 10.5,6 | D1.A 59.6,15.94 ISOLATE_EXT.2 ISOLATE_EXT.1
  Bottom 1.27: v17.5,17 32.9,17 33.2,16.7 56.3,16.7 ISOLATE_EXT.1
N$8
  Top 0.254: 54,16 PWR.A | 48,16 R4.1
  Top 0.305: 48,16 49.5,14.5 53.2,14.5 54.05,15.35 PWR.A
N$9
  Bottom 0.406: SJ4.2 53,42.22 MOTOR_2.MS3
N$10  (1 unrouted)
  Bottom 1.118: 3.5,61 3.5,60 8,55.5 12.5,55.5 14.5,53.5 MOTOR_1.2B
N$11  (1 unrouted)
  Bottom 1.118: 6,61 6,60 9,57 13.5,57 17,53.5 MOTOR_1.2A
N$12  (1 unrouted)
  Bottom 1.118: 8.5,61 8.5,60 10,58.5 14.5,58.5 19.5,53.5 MOTOR_1.1A
N$13  (1 unrouted)
  Bottom 1.118: 11,61 14.5,61 22,53.5 MOTOR_1.1B
N$14
  Top 0.254: TX.C 36,62 36,58 R6.1
N$15
  Top 0.254: RX.C 31,62 31,58 R7.1
N$16
  Bottom 0.406: SJ5.2 50,41.76 MOTOR_2.MS2
N$17
  Top 0.254: R8.1 47,37 47,40 46.5,40.5 MOTOR_2.MS1
  Bottom 0.406: SJ6.2 47,41.3 MOTOR_2.MS1
N$18
  Top 0.254: MOTOR_2.RST 54,40.5 56,40.5 MOTOR_2.SLP
N$19
  Top 0.254: M2_STEP.A 39,62 39,58 R10.1
N$24  (1 unrouted)
N$25  (1 unrouted)
N$26  (1 unrouted)
N$27  (1 unrouted)
N$28
  Top 0.254: SJ7.2 4.5,20 SPARE_BREAKOUT.4
RESET  (via drill 0.3)
  Top 0.254: RESET.3 15,4 21,4 RESET.4 | R5.1 66.6,21 71.7,26.1 71.7,43.2 77,48.5 U$2.RESET
  Top 0.305: v43,15 43,18 44,19 47,19 48,20 47.95,20.05 R5.1
  Bottom 0.254: RESET.4 21.5,3.5 28,3.5 29.5,2 NODEMCU-32S1.EN 30,2 31,1 40.5,1 41.3,1.9 41.3,12.8 v43,15
RX
  Top 0.254: 45,53 45,60 41.5,63.5 35.5,63.5 35,63 35,61.2 32.5,59.1 32.5,56.9 32.1,56.5 30,56.5 29,57.5 29.5,58 R7.2 | 49.5,48.5 50,48.5 50.5,48 50.5,46 46.5,42 43.5,42 37.5,36 37.5,27.5 NODEMCU-32S1.RX
  Top 0.305: 49.5,48.5 46.5,48.5 45,50 45,53
SD_CS
  Bottom 0.254: NODEMCU-32S1.P25 47.5,2 46,0.5 21.3,0.5 15.6,6 12.3,6 2,16.5 2,43 3.5,43 U$2.SD_CS
SERVO1  (via drill 0.3)
  Top 0.254: v48,45 45.5,45 32.5,32 32.5,27.5 NODEMCU-32S1.P22
  Bottom 0.254: 58.1,57 69.5,57 73.5,61 SERVO.3
  Bottom 0.406: v48,45 55.1,52.1 55.1,54 58.1,57
SPI_CLK
  Bottom 0.254: 47.6,32.5 76.5,32.5 77,33 U$2.T_CLK 77,33.5 78.5,34.9 78.5,39 77,40.5 U$2.SCK | 47.6,32.5 7,32.5 4,35.5 U$2.SD_SCK | NODEMCU-32S1.P18 47.6,32.5
SPI_MISO  (via drill 0.3)
  Top 0.254: v47,25.5 45.5,27 NODEMCU-32S1.P19 | U$2.T_DO 77,26 78.5,27.5 78.5,34 77,35.5 U$2.SDO-MISO
  Bottom 0.254: v47,25.5 77,25.5 U$2.T_DO | U$2.SD_MISO 4,38 9,33 74.5,33 77,35.5 U$2.SDO-MISO
SPI_MOSI  (via drill 0.3)
  Top 0.254: U$2.T_DIN 77,28.5 75.5,30 75.5,41.5 77,43 U$2.SDI-MOSI | v33.5,23.5 30,27 NODEMCU-32S1.P23
  Bottom 0.254: NODEMCU-32S1.P23 29.5,27.5 27.8,29.1 6.6,29.1 6,29.7 6,31.2 2.5,34.7 2.5,40.5 3.5,40.5 U$2.SD_MOSI | v33.5,23.5 52.5,23.5 53.5,24.5 77.8,24.5 78.5,25.2 78.5,26.5 77,28 U$2.T_DIN
T_CS
  Bottom 0.254: NODEMCU-32S1.P33 45.5,2 55,11.5 58,11.5 61.5,15 77,15 79,17 79,30.5 77,30.5 U$2.T_CS
T_IRQ
  Bottom 0.254: T_IRQ_LINK.1 76.5,19 76.5,23 77,23 U$2.T_IRQ
TFT_CS
  Bottom 0.254: NODEMCU-32S1.P5 50.5,27.5 55,32 78,32 79,33 79,51 77,51 U$2.CS
TFT_DC
  Top 0.254: NODEMCU-32S1.P26 50.5,2 51.5,1 61,1 61.6,1.6 61.6,3.6 62.5,4.5 62.5,17.5 65,20 68,20 75,27 75,43.5 77,45.5 U$2.D/C
TX  (via drill 0.3)
  Top 0.254: v35.5,42.5 34,44 34,58 R6.2 | v35.5,34 35.5,28 NODEMCU-32S1.TX
  Bottom 0.254: v35.5,34 v35.5,42.5

### Text on the board
Dimension: +
_tsilk: + | SD_CS | SD_MOSI | SD_MISO | SD_SCK | GP_1 | GP_2 | GND | SPI_MOSI | SERVO | TX | RX | GP_1 | GND | SPI_MISO | SPI_CLK | TFT_CS | GP_2 | GP_3 | M2_STEP | M2_DIR | ENC1 | GP_3 | 5V | ENC2 | 3.3V | GND | 3.3V | 3.3V | RESET | ENC1_A | ENC1_B | ENC2_A | ENC2_B | PEN_IRQ | T_CS | SD_CS | TFT_DC | M1_EN | M1_STEP | GND | M1_DIR | GND | M2_EN | 5V
_bsilk: SD CARD | VCC | GND | CS | RESET | SD_CS | SD_MOSI | T_IRQ | D/C | SDI (MOSI) | SCK | SD_MISO | LED | SD_SCK | SDO (MISO) | T_CLK (SCK) | T_CS | T_DIN (MOSI) | T_DOUT (MISO) | T_IRQ | Polarshield v3.0 | An open source art project. / 2018.04.22